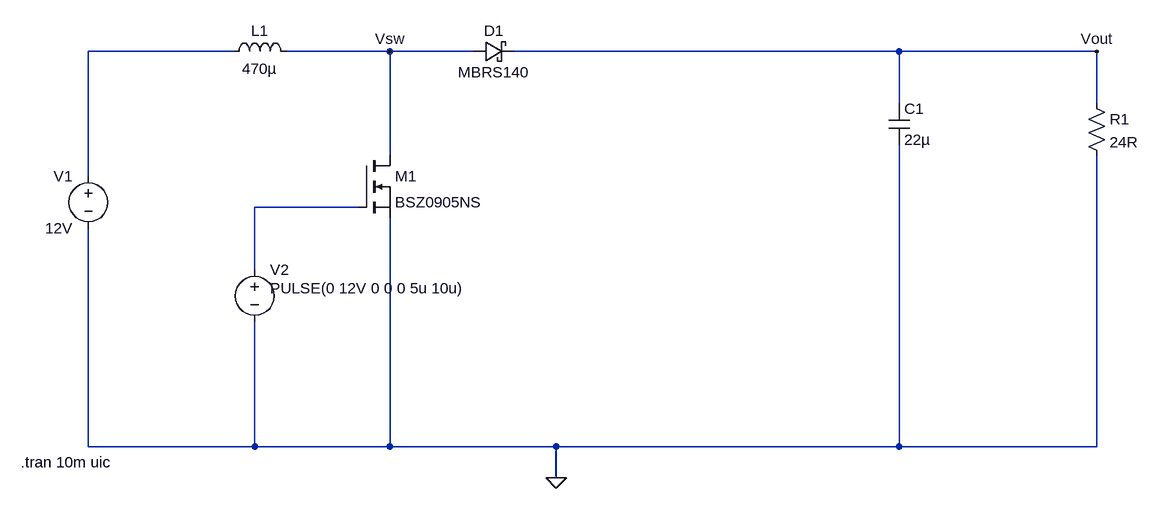
[diagram p0: schematic boost coverter mini project.asc]
boost coverter mini project.asc, the LTspice schematic file:
Version 4
SHEET 1 1652 680
WIRE 256 -192 32 -192
WIRE 496 -192 336 -192
WIRE 624 -192 496 -192
WIRE 1280 -192 688 -192
WIRE 1584 -192 1280 -192
WIRE 1280 -112 1280 -192
WIRE 1584 -112 1584 -192
WIRE 496 -32 496 -192
WIRE 32 0 32 -192
WIRE 448 48 288 48
WIRE 288 144 288 48
WIRE 32 416 32 80
WIRE 288 416 288 224
WIRE 288 416 32 416
WIRE 496 416 496 64
WIRE 496 416 288 416
WIRE 752 416 496 416
WIRE 1280 416 1280 -48
WIRE 1280 416 752 416
WIRE 1584 416 1584 -32
WIRE 1584 416 1280 416
WIRE 752 464 752 416
FLAG 752 464 0
FLAG 1584 -192 Vout
FLAG 496 -192 Vsw
SYMBOL ind 240 -176 R270
WINDOW 0 32 56 VTop 2
WINDOW 3 5 56 VBottom 2
SYMATTR InstName L1
SYMATTR Value 470µ
SYMBOL schottky 624 -176 R270
WINDOW 0 32 32 VTop 2
WINDOW 3 0 32 VBottom 2
SYMATTR InstName D1
SYMATTR Value MBRS140
SYMBOL res 1568 -128 R0
SYMATTR InstName R1
SYMATTR Value 24R
SYMBOL cap 1264 -112 R0
SYMATTR InstName C1
SYMATTR Value 22µ
SYMBOL nmos 448 -32 R0
SYMATTR InstName M1
SYMATTR Value BSZ0905NS
SYMBOL voltage 288 128 R0
WINDOW 3 24 44 Left 2
WINDOW 123 0 0 Left 0
WINDOW 39 0 0 Left 0
SYMATTR InstName V2
SYMATTR Value PULSE(0 12V 0 0 0 5u 10u)
SYMBOL voltage 32 -16 M0
SYMATTR InstName V1
SYMATTR Value 12V
TEXT -72 440 Left 2 !.tran 10m uic

The netlist it stands for:
* boost coverter mini project.asc
L1 N001 Vsw 470µ
D1 Vsw Vout MBRS140
R1 Vout 0 24R
C1 Vout 0 22µ
M1 Vsw N002 0 0 BSZ0905NS
V2 N002 0 PULSE(0 12V 0 0 0 5u 10u)
V1 N001 0 12V
.model D D
.lib standard.dio
.model NMOS NMOS
.model PMOS PMOS
.lib standard.mos
.tran 10m uic
.backanno
.end